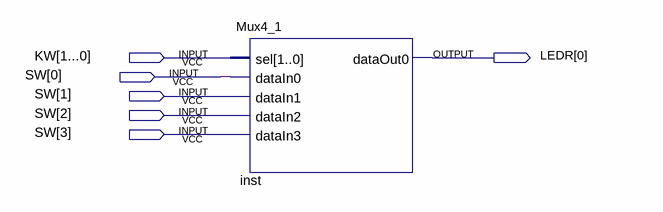
[diagram p0: schematic sheet]
// Quartus schematic mux4.1.bdf as structural Verilog: 1 symbols, 6 pins
module \mux4.1  (
  input  \KW[1...0] ,
  input  [3:0] SW,
  output [0:0] LEDR
);

  Mux4_1 inst (
    .sel({2{\KW[1...0] }}), .dataIn0(SW[0]), .dataIn1(SW[1]), .dataIn2(SW[2]), .dataIn3(SW[3]),
    .dataOut0(LEDR[0]));
endmodule
